# EAGLE design SENSOR PHOTOTRANSISTOR (EAGLE 7.2.0)
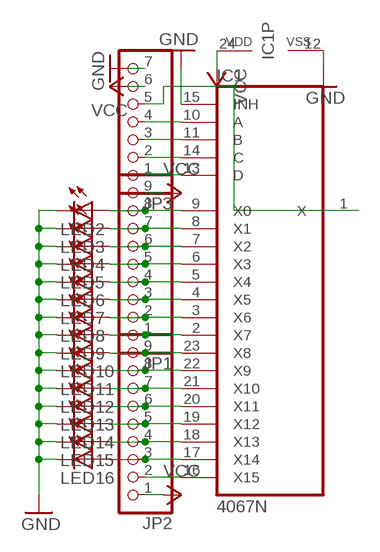
[diagram p0: schematic, sheet 1]

## Parts
IC1  4067N  [DIL24-6]
JP1  PINHD-1X9  [1X09]
JP2  PINHD-1X9  [1X09]
JP3  PINHD-1X7  [1X07]
LED2  LED5MM  [LED5MM]
LED3  LED5MM  [LED5MM]
LED4  LED5MM  [LED5MM]
LED5  LED5MM  [LED5MM]
LED6  LED5MM  [LED5MM]
LED7  LED5MM  [LED5MM]
LED8  LED5MM  [LED5MM]
LED9  LED5MM  [LED5MM]
LED10  LED5MM  [LED5MM]
LED11  LED5MM  [LED5MM]
LED12  LED5MM  [LED5MM]
LED13  LED5MM  [LED5MM]
LED14  LED5MM  [LED5MM]
LED15  LED5MM  [LED5MM]
LED16  LED5MM  [LED5MM]

## Nets
GND: IC1.12(VSS) IC1.15(INH) JP3.7 LED2.K(C) LED3.K(C) LED4.K(C) LED5.K(C) LED6.K(C) LED7.K(C) LED8.K(C) LED9.K(C) LED10.K(C) LED11.K(C) LED12.K(C) LED13.K(C) LED14.K(C) LED15.K(C) LED16.K(C)
N$1: IC1.9(X0) JP1.8 LED2.A
N$2: IC1.8(X1) JP1.7 LED3.A
N$3: IC1.7(X2) JP1.6 LED4.A
N$4: IC1.6(X3) JP1.5 LED5.A
N$5: IC1.5(X4) JP1.4 LED6.A
N$6: IC1.4(X5) JP1.3 LED7.A
N$7: IC1.3(X6) JP1.2 LED8.A
N$8: IC1.2(X7) JP1.1 LED9.A
N$9: IC1.23(X8) JP2.9 LED10.A
N$10: IC1.22(X9) JP2.8 LED11.A
N$11: IC1.21(X10) JP2.7 LED12.A
N$12: IC1.20(X11) JP2.6 LED13.A
N$13: IC1.19(X12) JP2.5 LED14.A
N$14: IC1.18(X13) JP2.4 LED15.A
N$15: IC1.17(X14) JP2.3 LED16.A
N$16: IC1.16(X15) JP2.2
N$18: IC1.13(D) JP3.1
N$19: IC1.14(C) JP3.2
N$20: IC1.11(B) JP3.3
N$21: IC1.10(A) JP3.4
N$22: IC1.1(X) JP3.5
VCC: IC1.24(VDD) JP1.9 JP2.1 JP3.6

## Library data of the parts
IC1 = 40xx:4067: 16-channel ANALOG MULTIPLEXER
JP1 JP2 = pinhead:PINHD-1X9: PIN HEADER
JP3 = pinhead:PINHD-1X7: PIN HEADER
LED2-LED16 = led:LED: LED OSRAM: - CHIPLED LG R971, LG N971, LY N971, LG Q971, LY Q971, LO R971, LY R971 LH N974, LH R974 LS Q976, LO Q976, LY Q976 LO Q996 - Hyper CHIPLED LW Q18S LB Q993, LB Q99A, LB R99A - SideLED LS A670, LO A670, LY A670, LG A670, LP A670 LB A673, LV A673, LT A673, LW A673 LH A674 LY A675 LS A676, LA A676, LO A676, LY A676, LW A676 LS A679, LY A679, LG A679 - Hyper Micro SIDELED® LS Y876, LA Y876, LO Y876, LY Y876 LT Y87S - SmartLED LW L88C, LW L88S LB L89C, LB L89S, LG L890 LS L89K, LO L89K, LY L89K LS L896, LA L896, LO L896, LY L896 - TOPLED LS T670, LO T670, LY T670, LG T670, LP T670 LSG T670, LSP T670, LSY T670, LOP T670, LYG T670 LG T671, LOG T671, LSG T671 LB T673, LV T673, LT T673, LW T673 LH T674 LS T676, LA T676, LO T676, LY T676, LB T676, LH T676, LSB T676, LW T676 LB T67C, LV T67C, LT T67C, LS T67K, LO T67K, LY T67K, LW E67C LS E67B, LA E67B, LO E67B, LY E67B, LB E67C, LV E67C, LT E67C LW T67C LS T679, LY T679, LG T679 LS T770, LO T770, LY T770, LG T770, LP T770 LB T773, LV T773, LT T773, LW T773 LH T774 LS E675, LA E675, LY E675, LS T675 LS T776, LA T776, LO T776, LY T776, LB T776 LHGB T686 LT T68C, LB T68C - Hyper Mini TOPLED® LB M676 - Mini TOPLED Santana® LG M470 LS M47K, LO M47K, LY M47K Source: http://www.osram.convergy.de LUXEON: - LUMILED® LXK2-PW12-R00, LXK2-PW12-S00, LXK2-PW14-U00, LXK2-PW14-V00 LXK2-PM12-R00, LXK2-PM12-S00, LXK2-PM14-U00 LXK2-PE12-Q00, LXK2-PE12-R00, LXK2-PE12-S00, LXK2-PE14-T00, LXK2-PE14-U00 LXK2-PB12-K00, LXK2-PB12-L00, LXK2-PB12-M00, LXK2-PB14-N00, LXK2-PB14-P00, LXK2-PB14-Q00 LXK2-PR12-L00, LXK2-PR12-M00, LXK2-PR14-Q00, LXK2-PR14-R00 LXK2-PD12-Q00, LXK2-PD12-R00, LXK2-PD12-S00 LXK2-PH12-R00, LXK2-PH12-S00 LXK2-PL12-P00, LXK2-PL12-Q00, LXK2-PL12-R00 Source: www.luxeon.com KINGBRIGHT: KA-3528ASYC Source: www.kingbright.com

## Board
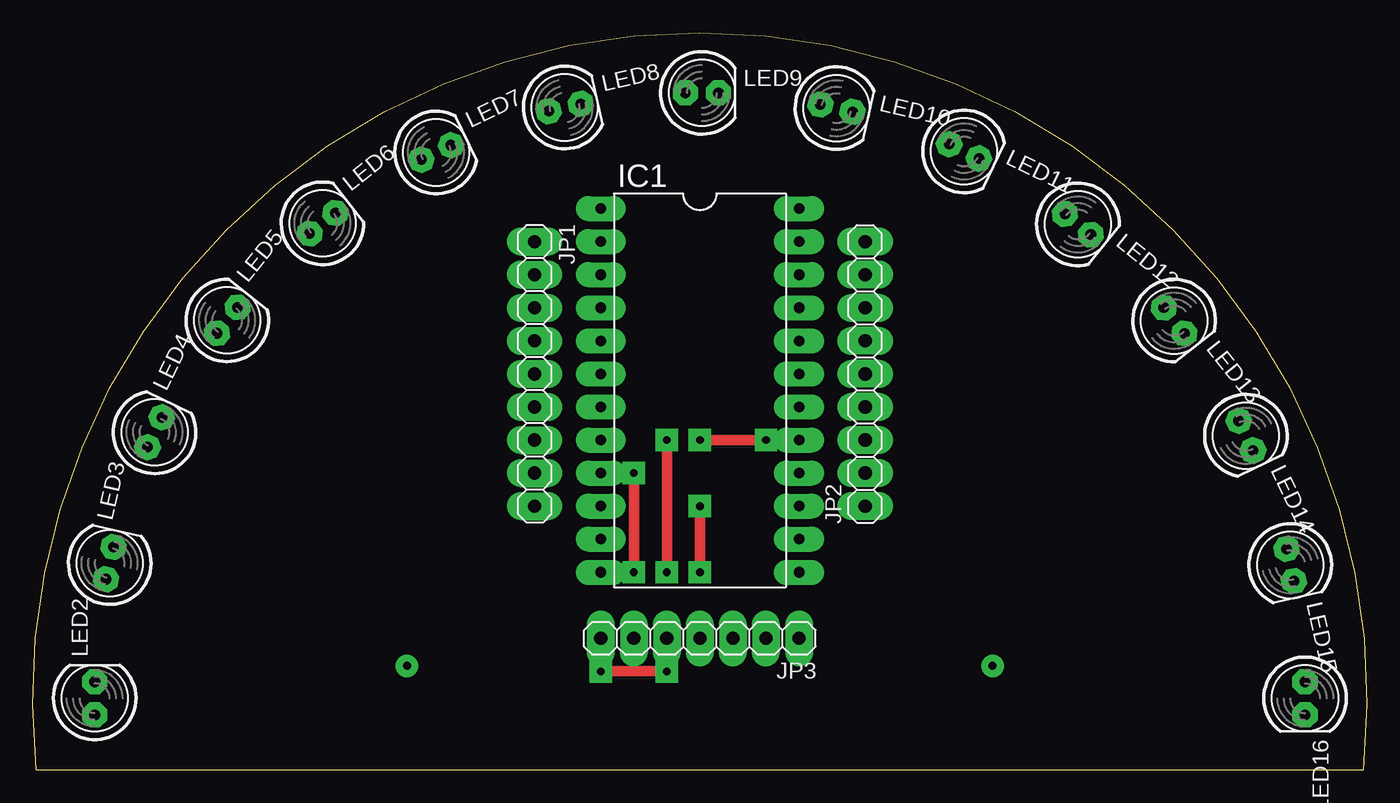
[diagram p1: board, top side]
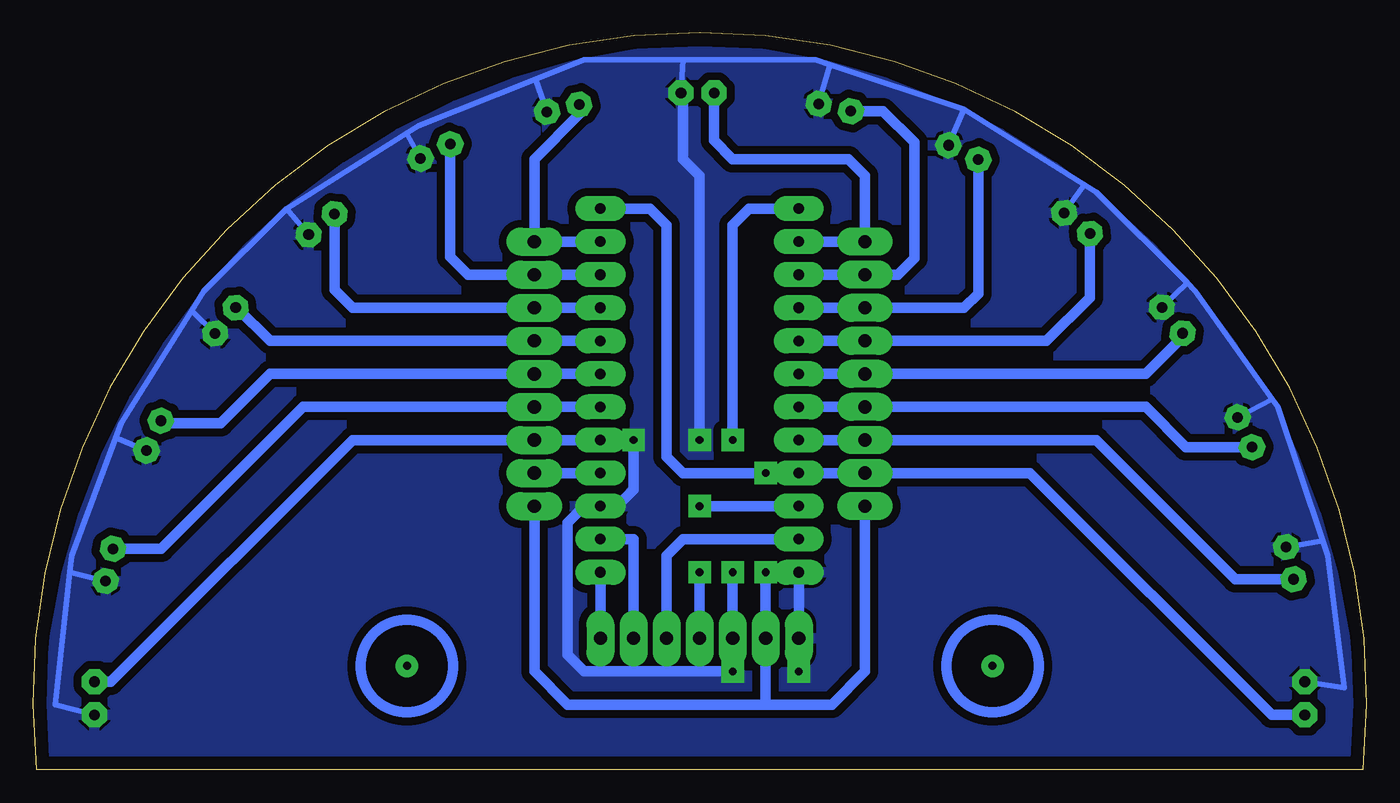
[diagram p2: board, bottom side, seen from below]

Size 102.56 x 56.66 mm. Coordinates in mm from the lower left corner, seen from the top.
Outline: 0.28,0 arc-192 102.28,0 0.28,0
Copper layers (1*16): Top 0.035mm / dielectric 1.5mm / Bottom 0.035mm
Design rules "default *": minimum track width 10mil, minimum drill 24mil, track to track 8mil, track to pad 8mil, pad to pad 8mil, via to via 8mil, smd to smd 8mil, copper to edge 40mil, drill to drill 8mil, minimum pad ring 22mil, minimum via ring 22mil, stop-mask expansion 4mil, vias tented up to drill 0mil, thermal gap 10mil

### Footprints (pad centres in the part's own frame; a part is rotated, then mirrored left to right if it is on the bottom)
DIL24-6 = drill 0.813 long: 1 -13.97,-7.62; 2 -11.43,-7.62; 3 -8.89,-7.62; 4 -6.35,-7.62; 5 -3.81,-7.62; 6 -1.27,-7.62; 7 1.27,-7.62; 8 3.81,-7.62; 9 6.35,-7.62; 10 8.89,-7.62; 11 11.43,-7.62; 12 13.97,-7.62; 13 13.97,7.62; 14 11.43,7.62; 15 8.89,7.62; 16 6.35,7.62; 17 3.81,7.62; 18 1.27,7.62; 19 -1.27,7.62; 20 -3.81,7.62; 21 -6.35,7.62; 22 -8.89,7.62; 23 -11.43,7.62; 24 -13.97,7.62
1X09 = drill 1.016 long: 1 -10.16,0; 2 -7.62,0; 3 -5.08,0; 4 -2.54,0; 5 0,0; 6 2.54,0; 7 5.08,0; 8 7.62,0; 9 10.16,0
1X07 = drill 1.016 long: 1 -7.62,0; 2 -5.08,0; 3 -2.54,0; 4 0,0; 5 2.54,0; 6 5.08,0; 7 7.62,0
LED5MM = drill 0.813 octagon: A -1.27,0; K 1.27,0

### Placement (x,y rotation side)
IC1  51.29,29.16 270 top
JP1  38.59,30.43 270 top
JP2  63.99,30.43 90 top
JP3  51.29,10.11 180 top
LED2  4.78,5.51 90 top
LED3  5.93,15.89 77.1 top
LED4  9.38,25.94 64.2 top
LED5  14.97,34.55 51.4 top
LED6  22.29,42 38.5 top
LED7  31.02,47.44 25.7 top
LED8  40.9,50.9 12.8 top
LED9  51.45,52.02 0 top
LED10  61.79,50.85 347.1 top
LED11  71.6,47.53 334.2 top
LED12  80.35,41.92 321.4 top
LED13  87.74,34.53 308.5 top
LED14  93.26,25.69 295.7 top
LED15  96.66,15.75 282.8 top
LED16  97.81,5.51 270 top

### Tracks (layer width: path | path; a pad name or v marks a point on that pad's centre or on a via)
GND  (via drill 0.6)
  Top 0.813: v43.67,7.57 v48.75,7.57 | v56.37,25.35 v51.29,25.35
  Bottom 0.406: LED2.K 1.76,6.3 3.03,16.46 3.41,17.6 | 3.41,17.6 6.84,27.89 7.27,28.49 | 7.27,28.49 13.19,36.78 13.83,37.42 | 13.83,37.42 20.81,44.4 21.72,44.97 | 21.72,44.97 30.97,50.75 | 30.97,50.75 41.26,54.18 | 41.26,54.18 42.4,54.56 52.56,54.56 | 52.56,54.56 60.18,54.56 63.9,53.07 | 63.9,53.07 72.88,49.48 73.79,48.91 | 73.79,48.91 83.04,43.13 | 83.04,43.13 89.39,36.78 90.32,35.3 | 90.32,35.3 95.74,26.62 96.16,25.51 | 96.16,25.51 99.55,16.46 99.69,15.2 | 99.69,15.2 100.82,5.03 LED16.K | LED3.K 3.41,17.6 | LED4.K 7.27,28.49 | LED5.K 13.83,37.42 | LED6.K 21.72,44.97 | LED7.K 30.97,50.75 | LED8.K 41.26,54.18 | LED9.K 52.56,54.56 | LED10.K 63.9,53.07 | LED11.K 73.79,48.91 | LED12.K 83.04,43.13 | LED13.K 90.32,35.3 | LED14.K 96.16,25.51 | LED15.K 99.69,15.2
  Bottom 0.813: IC1.12 JP3.7 v43.67,7.57 | v48.75,7.57 60.18,7.57 61.45,8.84 61.45,19 60.18,20.27 IC1.15 57.64,20.27 56.37,21.54 v56.37,25.35 | v51.29,25.35 51.29,45.67 52.56,46.94 52.56,51.86 LED9.K
  pour Bottom (isolate 0.61): 1.28,0.5 arc-90 51.28,55.5 arc-90 101.28,0.5
N$1
  Bottom 0.813: IC1.9 JP1.8 25.89,22.81 7.32,4.24 LED2.A
N$2
  Bottom 0.813: IC1.8 JP1.7 20.81,25.35 10.12,14.65 LED3.A
N$3
  Bottom 0.813: IC1.7 JP1.6 17,27.89 13.91,24.8 LED4.A
N$4
  Bottom 0.813: IC1.6 JP1.5 17,30.43 14.17,33.26 LED5.A
N$5
  Bottom 0.813: IC1.5 JP1.4 24.62,32.97 21.29,36.3 LED6.A
N$6
  Bottom 0.813: IC1.4 JP1.3 30.97,35.51 29.88,36.61 LED7.A
N$7
  Bottom 0.813: IC1.3 JP1.2 36.05,38.05 34.78,39.32 34.78,48.21 37.19,50.62 LED8.A
N$8
  Bottom 0.813: IC1.2 JP1.1 38.59,45.67 39.86,46.94 48.75,46.94 50.18,48.37 LED9.A
N$9
  Bottom 0.813: IC1.23 JP2.9 63.99,46.94 60.55,50.38 LED10.A
N$10
  Bottom 0.813: IC1.22 JP2.8 69.07,38.05 70.45,39.43 LED11.A
N$11
  Bottom 0.813: IC1.21 JP2.7 77.96,35.51 79.36,36.9 LED12.A
N$12
  Bottom 0.813: IC1.20 JP2.6 84.31,32.97 86.86,35.52 LED13.A
N$13
  Bottom 0.813: IC1.19 JP2.5 84.31,30.43 88.12,26.62 92.49,26.62 LED14.A
N$14
  Bottom 0.813: IC1.18 JP2.4 81.77,27.89 92.67,16.99 LED15.A
N$15
  Bottom 0.813: IC1.17 JP2.3 77.96,25.35 96.54,6.78 LED16.A
N$16
  Bottom 0.813: IC1.16 JP2.2
N$17  (via drill 0.6)
  other vias: 28.78,8
N$18
  Bottom 0.813: IC1.13 JP3.1
N$19
  Bottom 0.813: IC1.14 56.37,17.73 JP3.2
N$20
  Bottom 0.813: IC1.11 52.56,17.73 53.83,16.46 JP3.3
N$21  (via drill 0.6)
  Top 0.813: v51.29,15.19 v51.29,20.27
  Bottom 0.813: JP3.4 v51.29,15.19 | v51.29,20.27 IC1.10
N$22  (via drill 0.6)
  Top 0.813: v48.75,15.19 v48.75,25.35
  Bottom 0.813: JP3.5 v48.75,15.19 | v48.75,25.35 48.75,41.86 47.48,43.13 IC1.1
N$23  (via drill 0.6)
  other vias: 73.78,8
VCC  (via drill 0.6)
  Top 0.813: v46.21,22.81 v46.21,15.19
  Bottom 0.813: JP1.9 38.59,7.57 41.13,5.03 46.21,5.03 | 46.21,5.03 61.45,5.03 63.99,7.57 JP2.1 | 46.21,5.03 JP3.6 v46.21,15.19 | IC1.24 55.1,43.13 53.83,41.86 53.83,24.08 52.56,22.81 v46.21,22.81
(copper drawn outside any net)
  shapes: Bottom circle x2